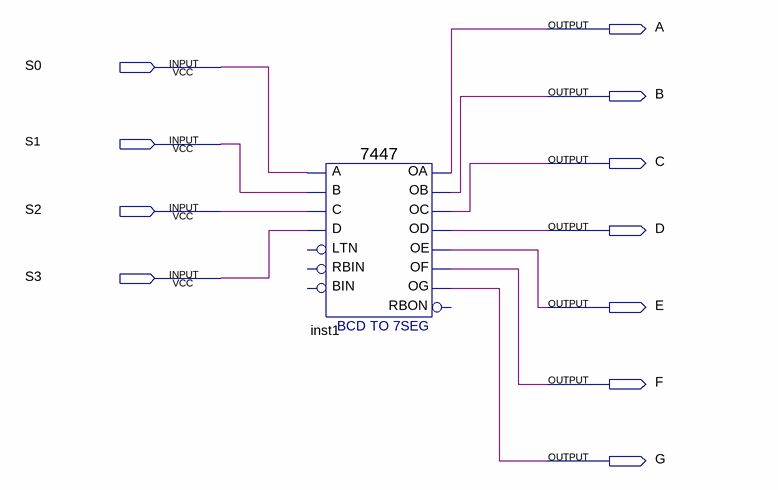
[diagram p0: schematic sheet]
// Quartus schematic exercise1.bdf as structural Verilog: 1 symbols, 11 pins
module exercise1 (
  input  S0,
  input  S1,
  input  S2,
  input  S3,
  output A,
  output B,
  output C,
  output D,
  output E,
  output F,
  output G
);

  \7447  inst1 (
    .B(S1), .C(S2), .D(S3), .A(S0), .OB(B), .OC(C), .OE(E), .OD(D), .OF(F), .OG(G), .OA(A));  // open: LTN, RBIN, BIN, RBON
endmodule
